# EAGLE design tron_disc (EAGLE 5.11)

## Sheet 1 of 3
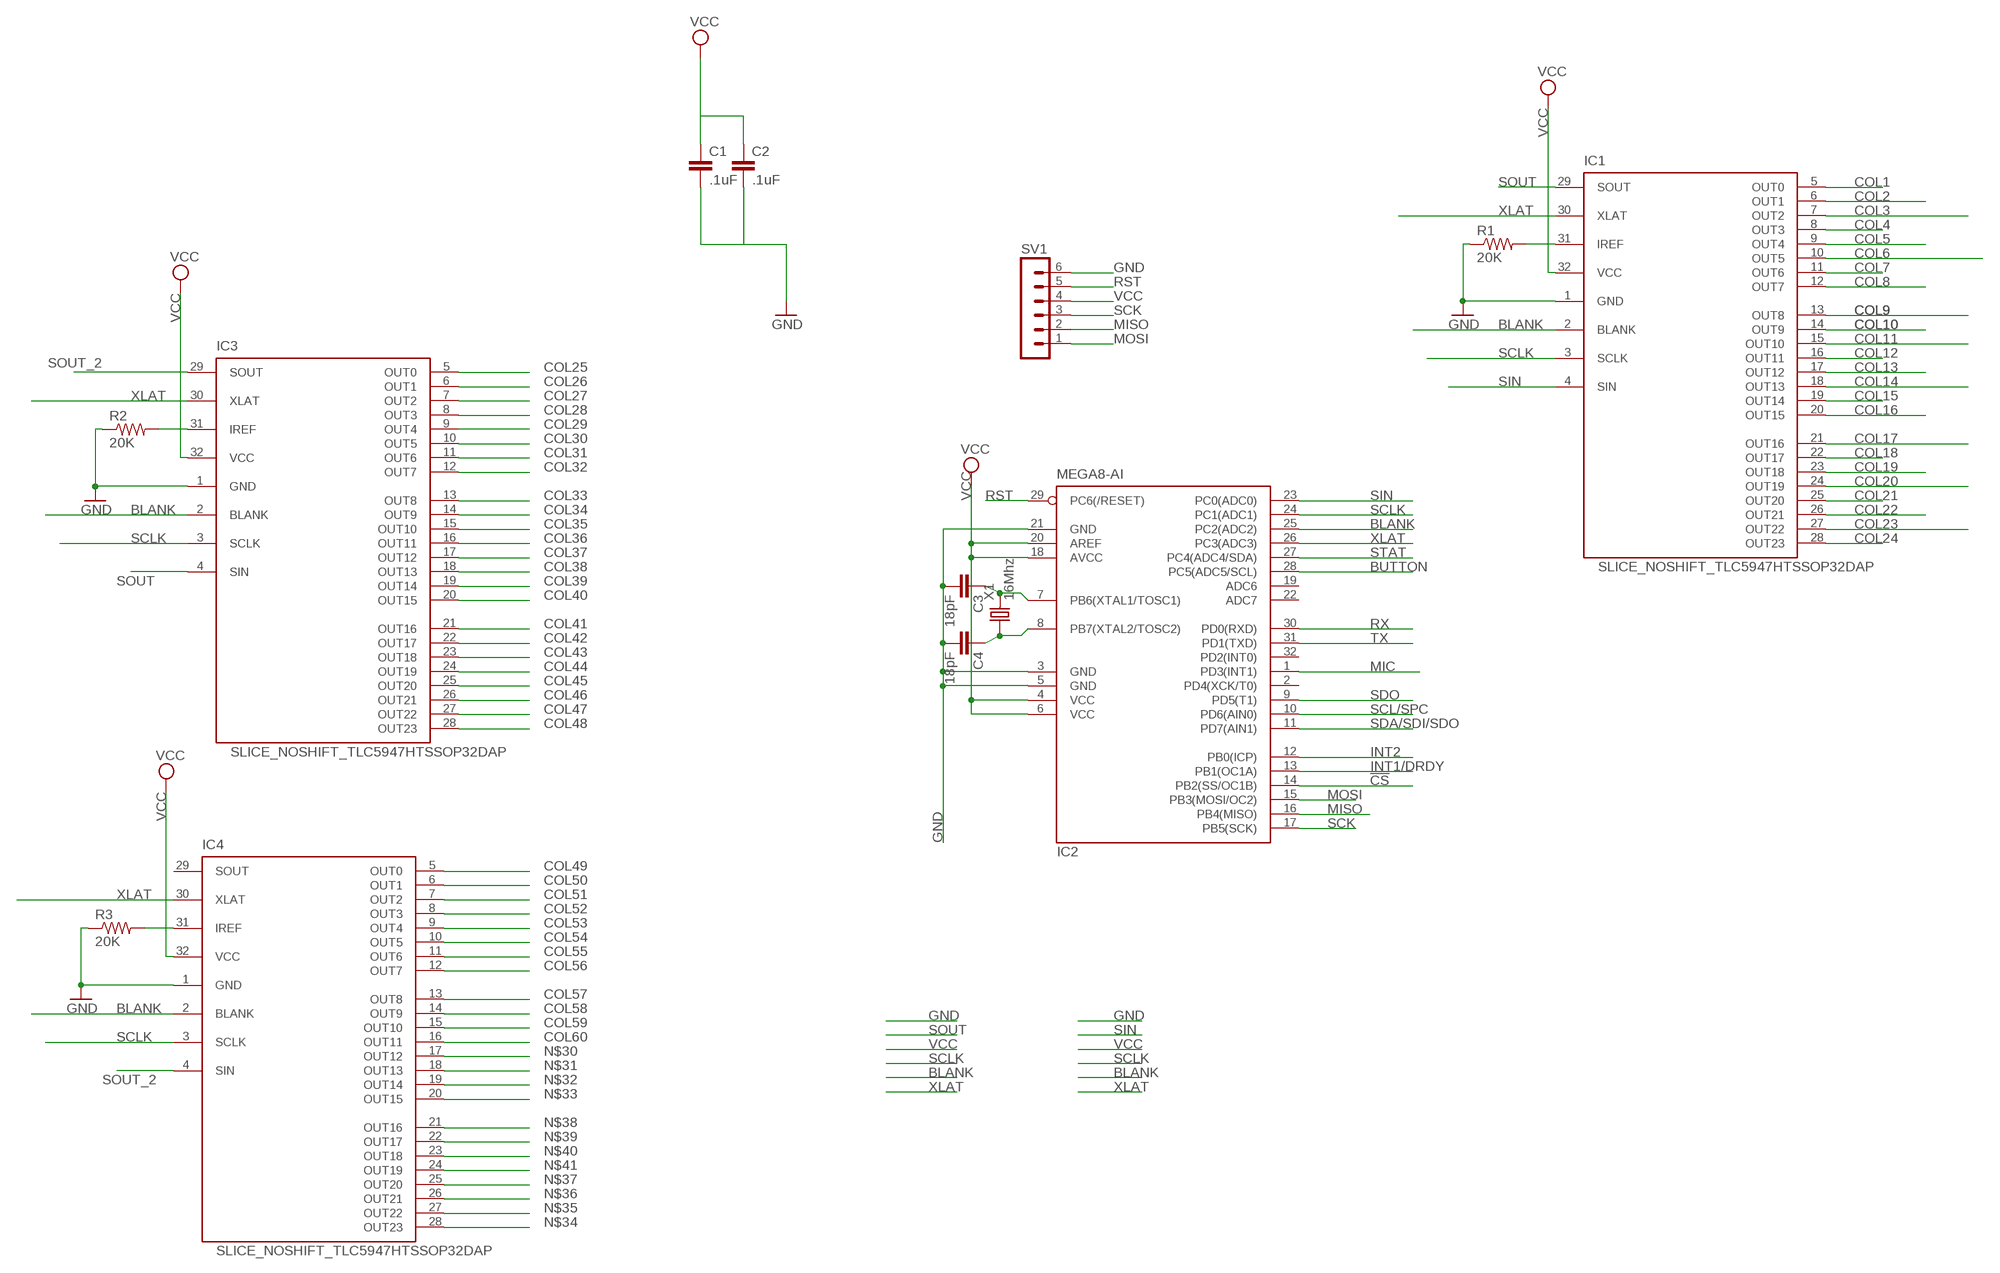
[diagram p0: schematic, sheet 1]

### Parts
C1  .1uF  CAP0805  [0805]
C2  .1uF  CAP0805  [0805]
C3  18pF  CAP0805  [0805]
C4  18pF  CAP0805  [0805]
IC1  SLICE_NOSHIFT_TLC5947HTSSOP32DAP  [HTSSOP32DAP]
IC2  MEGA8-AI  [TQFP32-08]
IC3  SLICE_NOSHIFT_TLC5947HTSSOP32DAP  [HTSSOP32DAP]
IC4  SLICE_NOSHIFT_TLC5947HTSSOP32DAP  [HTSSOP32DAP]
R1  20K  R-US_R0805  [R0805]
R2  20K  R-US_R0805  [R0805]
R3  20K  R-US_R0805  [R0805]
SV1  MA06-1  [MA06-1]
X1  16Mhz  CRYSTAL-5032  [5032]

### Nets
!CS: IC2.14(PB2(SS/OC1B))
BLANK: IC1.2(BLANK) IC2.25(PC2(ADC2)) IC3.2(BLANK) IC4.2(BLANK)
BUTTON: IC2.28(PC5(ADC5/SCL)) ; also sheet 3
COL1: IC1.5(OUT0) ; also sheet 2
COL2: IC1.6(OUT1) ; also sheet 2
COL3: IC1.7(OUT2) ; also sheet 2
COL4: IC1.8(OUT3) ; also sheet 2
COL5: IC1.9(OUT4) ; also sheet 2
COL6: IC1.10(OUT5) ; also sheet 2
COL7: IC1.11(OUT6) ; also sheet 2
COL8: IC1.12(OUT7) ; also sheet 2
COL9: IC1.13(OUT8) ; also sheet 2
COL10: IC1.14(OUT9) ; also sheet 2
COL11: IC1.15(OUT10) ; also sheet 2
COL12: IC1.16(OUT11) ; also sheet 2
COL13: IC1.17(OUT12) ; also sheet 2
COL14: IC1.18(OUT13) ; also sheet 2
COL15: IC1.19(OUT14) ; also sheet 2
COL16: IC1.20(OUT15) ; also sheet 2
COL17: IC1.21(OUT16) ; also sheet 2
COL18: IC1.22(OUT17) ; also sheet 2
COL19: IC1.23(OUT18) ; also sheet 2
COL20: IC1.24(OUT19) ; also sheet 2
COL21: IC1.25(OUT20) ; also sheet 2
COL22: IC1.26(OUT21) ; also sheet 2
COL23: IC1.27(OUT22) ; also sheet 2
COL24: IC1.28(OUT23) ; also sheet 2
COL25: IC3.5(OUT0) ; also sheet 2
COL26: IC3.6(OUT1) ; also sheet 2
COL27: IC3.7(OUT2) ; also sheet 2
COL28: IC3.8(OUT3) ; also sheet 2
COL29: IC3.9(OUT4) ; also sheet 2
COL30: IC3.10(OUT5) ; also sheet 2
COL31: IC3.11(OUT6) ; also sheet 2
COL32: IC3.12(OUT7) ; also sheet 2
COL33: IC3.13(OUT8) ; also sheet 2
COL34: IC3.14(OUT9) ; also sheet 2
COL35: IC3.15(OUT10) ; also sheet 2
COL36: IC3.16(OUT11) ; also sheet 2
COL37: IC3.17(OUT12) ; also sheet 2
COL38: IC3.18(OUT13) ; also sheet 2
COL39: IC3.19(OUT14) ; also sheet 2
COL40: IC3.20(OUT15) ; also sheet 2
COL41: IC3.21(OUT16) ; also sheet 2
COL42: IC3.22(OUT17) ; also sheet 2
COL43: IC3.23(OUT18) ; also sheet 2
COL44: IC3.24(OUT19) ; also sheet 2
COL45: IC3.25(OUT20) ; also sheet 2
COL46: IC3.26(OUT21) ; also sheet 2
COL47: IC3.27(OUT22) ; also sheet 2
COL48: IC3.28(OUT23) ; also sheet 2
COL49: IC4.5(OUT0) ; also sheet 2
COL50: IC4.6(OUT1) ; also sheet 2
COL51: IC4.7(OUT2) ; also sheet 2
COL52: IC4.8(OUT3) ; also sheet 2
COL53: IC4.9(OUT4) ; also sheet 2
COL54: IC4.10(OUT5) ; also sheet 2
COL55: IC4.11(OUT6) ; also sheet 2
COL56: IC4.12(OUT7) ; also sheet 2
COL57: IC4.13(OUT8) ; also sheet 2
COL58: IC4.14(OUT9) ; also sheet 2
COL59: IC4.15(OUT10) ; also sheet 2
COL60: IC4.16(OUT11) ; also sheet 2
GND: C1.2 C2.2 C3.2 C4.2 IC1.1(GND) IC2.3(GND) IC2.5(GND) IC2.21(GND) IC3.1(GND) IC4.1(GND) R1.1 R2.1 R3.1 SV1.6 ; also sheet 3
INT1/DRDY: IC2.13(PB1(OC1A))
INT2: IC2.12(PB0(ICP))
MIC: IC2.1(PD3(INT1))
MISO: IC2.16(PB4(MISO)) SV1.2
MOSI: IC2.15(PB3(MOSI/OC2)) SV1.1
N$1: IC3.31(IREF) R2.2
N$7: C3.1 IC2.7(PB6(XTAL1/TOSC1)) X1.2
N$8: C4.1 IC2.8(PB7(XTAL2/TOSC2)) X1.1
N$13: IC1.31(IREF) R1.2
N$30: IC4.17(OUT12)
N$31: IC4.18(OUT13)
N$32: IC4.19(OUT14)
N$33: IC4.20(OUT15)
N$34: IC4.28(OUT23)
N$35: IC4.27(OUT22)
N$36: IC4.26(OUT21)
N$37: IC4.25(OUT20)
N$38: IC4.21(OUT16)
N$39: IC4.22(OUT17)
N$40: IC4.23(OUT18)
N$41: IC4.24(OUT19)
N$64: IC4.31(IREF) R3.2
RST: IC2.29(PC6(/RESET)) SV1.5 ; also sheet 3
RX: IC2.30(PD0(RXD))
SCK: IC2.17(PB5(SCK)) SV1.3
SCL/SPC: IC2.10(PD6(AIN0))
SCLK: IC1.3(SCLK) IC2.24(PC1(ADC1)) IC3.3(SCLK) IC4.3(SCLK)
SDA/SDI/SDO: IC2.11(PD7(AIN1))
SDO: IC2.9(PD5(T1))
SIN: IC1.4(SIN) IC2.23(PC0(ADC0))
SOUT: IC1.29(SOUT) IC3.4(SIN)
SOUT_2: IC3.29(SOUT) IC4.4(SIN)
STAT: IC2.27(PC4(ADC4/SDA))
TX: IC2.31(PD1(TXD))
VCC: C1.1 C2.1 IC1.32(VCC) IC2.4(VCC) IC2.6(VCC) IC2.18(AVCC) IC2.20(AREF) IC3.32(VCC) IC4.32(VCC) SV1.4 ; also sheet 2
XLAT: IC1.30(XLAT) IC2.26(PC3(ADC3)) IC3.30(XLAT) IC4.30(XLAT)
Unconnected: IC2.2(PD4(XCK/T0)) IC2.19(ADC6) IC2.22(ADC7) IC2.32(PD2(INT0)) IC4.29(SOUT)

## Sheet 2 of 3
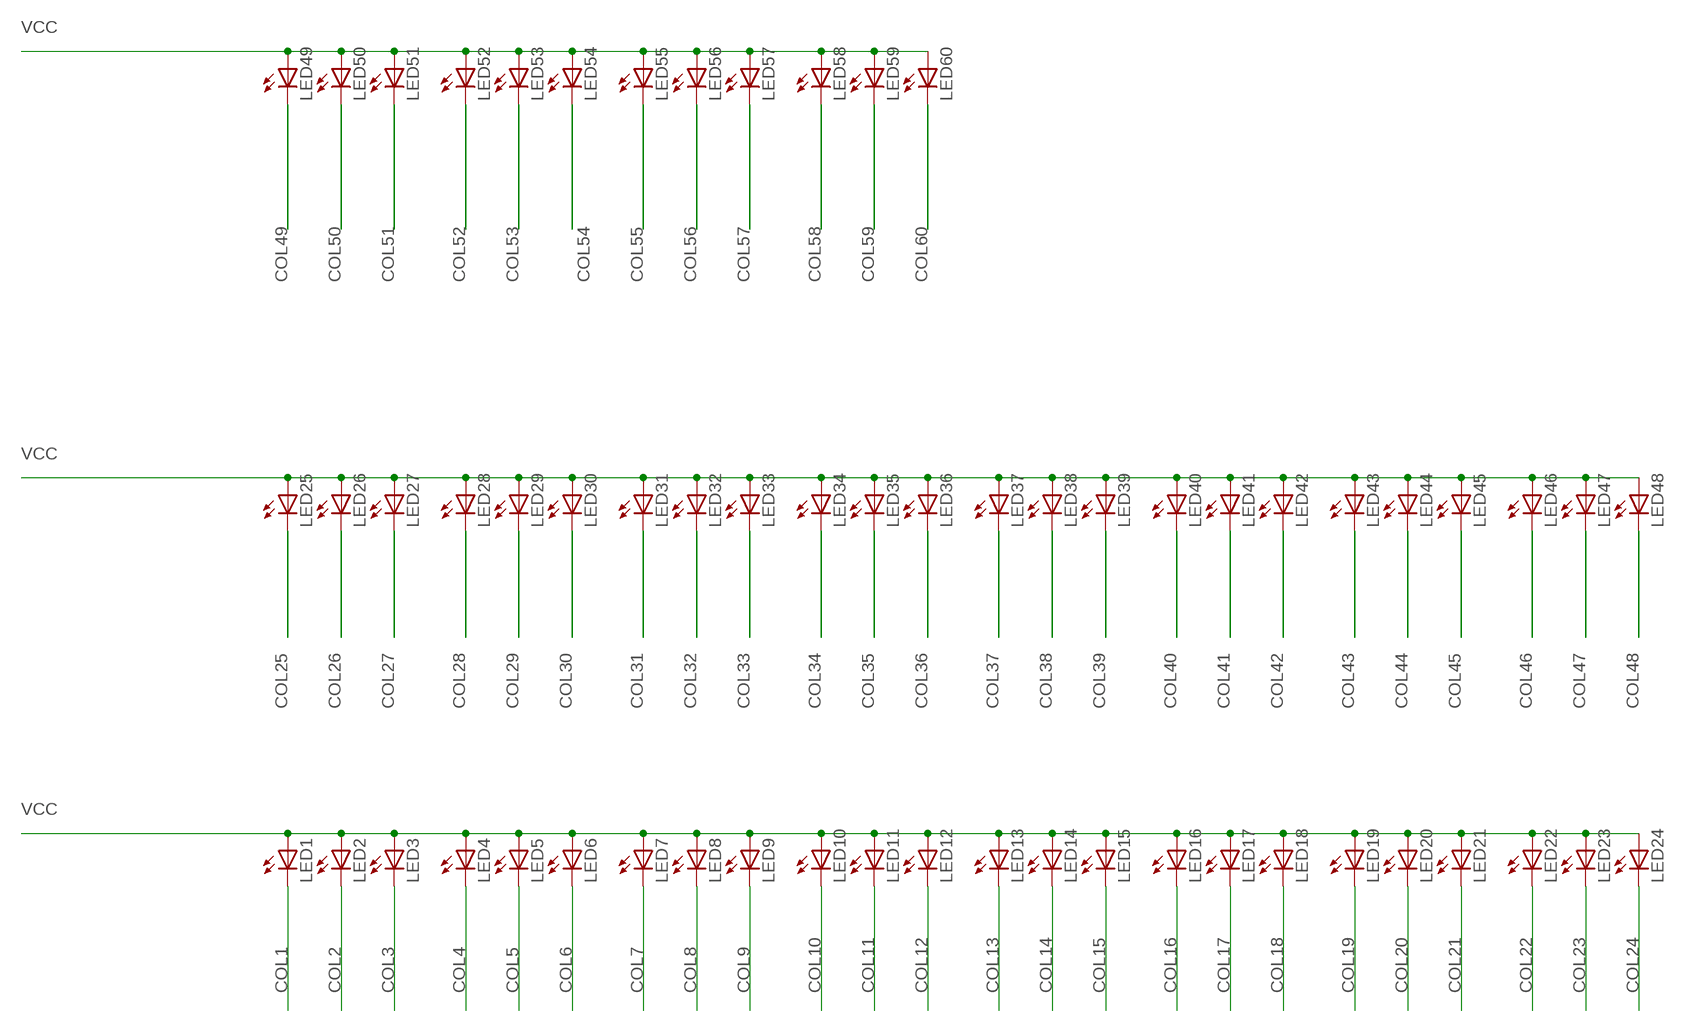
[diagram p1: schematic, sheet 2]

### Parts
LED1  LED5MM  [LED5MM]
LED2  LED5MM  [LED5MM]
LED3  LED5MM  [LED5MM]
LED4  LED5MM  [LED5MM]
LED5  LED5MM  [LED5MM]
LED6  LED5MM  [LED5MM]
LED7  LED5MM  [LED5MM]
LED8  LED5MM  [LED5MM]
LED9  LED5MM  [LED5MM]
LED10  LED5MM  [LED5MM]
LED11  LED5MM  [LED5MM]
LED12  LED5MM  [LED5MM]
LED13  LED5MM  [LED5MM]
LED14  LED5MM  [LED5MM]
LED15  LED5MM  [LED5MM]
LED16  LED5MM  [LED5MM]
LED17  LED5MM  [LED5MM]
LED18  LED5MM  [LED5MM]
LED19  LED5MM  [LED5MM]
LED20  LED5MM  [LED5MM]
LED21  LED5MM  [LED5MM]
LED22  LED5MM  [LED5MM]
LED23  LED5MM  [LED5MM]
LED24  LED5MM  [LED5MM]
LED25  LED5MM  [LED5MM]
LED26  LED5MM  [LED5MM]
LED27  LED5MM  [LED5MM]
LED28  LED5MM  [LED5MM]
LED29  LED5MM  [LED5MM]
LED30  LED5MM  [LED5MM]
LED31  LED5MM  [LED5MM]
LED32  LED5MM  [LED5MM]
LED33  LED5MM  [LED5MM]
LED34  LED5MM  [LED5MM]
LED35  LED5MM  [LED5MM]
LED36  LED5MM  [LED5MM]
LED37  LED5MM  [LED5MM]
LED38  LED5MM  [LED5MM]
LED39  LED5MM  [LED5MM]
LED40  LED5MM  [LED5MM]
LED41  LED5MM  [LED5MM]
LED42  LED5MM  [LED5MM]
LED43  LED5MM  [LED5MM]
LED44  LED5MM  [LED5MM]
LED45  LED5MM  [LED5MM]
LED46  LED5MM  [LED5MM]
LED47  LED5MM  [LED5MM]
LED48  LED5MM  [LED5MM]
LED49  LED5MM  [LED5MM]
LED50  LED5MM  [LED5MM]
LED51  LED5MM  [LED5MM]
LED52  LED5MM  [LED5MM]
LED53  LED5MM  [LED5MM]
LED54  LED5MM  [LED5MM]
LED55  LED5MM  [LED5MM]
LED56  LED5MM  [LED5MM]
LED57  LED5MM  [LED5MM]
LED58  LED5MM  [LED5MM]
LED59  LED5MM  [LED5MM]
LED60  LED5MM  [LED5MM]

### Nets
COL1: LED1.K(C) ; also sheet 1
COL2: LED2.K(C) ; also sheet 1
COL3: LED3.K(C) ; also sheet 1
COL4: LED4.K(C) ; also sheet 1
COL5: LED5.K(C) ; also sheet 1
COL6: LED6.K(C) ; also sheet 1
COL7: LED7.K(C) ; also sheet 1
COL8: LED8.K(C) ; also sheet 1
COL9: LED9.K(C) ; also sheet 1
COL10: LED10.K(C) ; also sheet 1
COL11: LED11.K(C) ; also sheet 1
COL12: LED12.K(C) ; also sheet 1
COL13: LED13.K(C) ; also sheet 1
COL14: LED14.K(C) ; also sheet 1
COL15: LED15.K(C) ; also sheet 1
COL16: LED16.K(C) ; also sheet 1
COL17: LED17.K(C) ; also sheet 1
COL18: LED18.K(C) ; also sheet 1
COL19: LED19.K(C) ; also sheet 1
COL20: LED20.K(C) ; also sheet 1
COL21: LED21.K(C) ; also sheet 1
COL22: LED22.K(C) ; also sheet 1
COL23: LED23.K(C) ; also sheet 1
COL24: LED24.K(C) ; also sheet 1
COL25: LED25.K(C) ; also sheet 1
COL26: LED26.K(C) ; also sheet 1
COL27: LED27.K(C) ; also sheet 1
COL28: LED28.K(C) ; also sheet 1
COL29: LED29.K(C) ; also sheet 1
COL30: LED30.K(C) ; also sheet 1
COL31: LED31.K(C) ; also sheet 1
COL32: LED32.K(C) ; also sheet 1
COL33: LED33.K(C) ; also sheet 1
COL34: LED34.K(C) ; also sheet 1
COL35: LED35.K(C) ; also sheet 1
COL36: LED36.K(C) ; also sheet 1
COL37: LED37.K(C) ; also sheet 1
COL38: LED38.K(C) ; also sheet 1
COL39: LED39.K(C) ; also sheet 1
COL40: LED40.K(C) ; also sheet 1
COL41: LED41.K(C) ; also sheet 1
COL42: LED42.K(C) ; also sheet 1
COL43: LED43.K(C) ; also sheet 1
COL44: LED44.K(C) ; also sheet 1
COL45: LED45.K(C) ; also sheet 1
COL46: LED46.K(C) ; also sheet 1
COL47: LED47.K(C) ; also sheet 1
COL48: LED48.K(C) ; also sheet 1
COL49: LED49.K(C) ; also sheet 1
COL50: LED50.K(C) ; also sheet 1
COL51: LED51.K(C) ; also sheet 1
COL52: LED52.K(C) ; also sheet 1
COL53: LED53.K(C) ; also sheet 1
COL54: LED54.K(C) ; also sheet 1
COL55: LED55.K(C) ; also sheet 1
COL56: LED56.K(C) ; also sheet 1
COL57: LED57.K(C) ; also sheet 1
COL58: LED58.K(C) ; also sheet 1
COL59: LED59.K(C) ; also sheet 1
COL60: LED60.K(C) ; also sheet 1
VCC: LED1.A LED2.A LED3.A LED4.A LED5.A LED6.A LED7.A LED8.A LED9.A LED10.A LED11.A LED12.A LED13.A LED14.A LED15.A LED16.A LED17.A LED18.A LED19.A LED20.A LED21.A LED22.A LED23.A LED24.A LED25.A LED26.A LED27.A LED28.A LED29.A LED30.A LED31.A LED32.A LED33.A LED34.A LED35.A LED36.A LED37.A LED38.A LED39.A LED40.A LED41.A LED42.A LED43.A LED44.A LED45.A LED46.A LED47.A LED48.A LED49.A LED50.A LED51.A LED52.A LED53.A LED54.A LED55.A LED56.A LED57.A LED58.A LED59.A LED60.A ; also sheet 1

## Sheet 3 of 3
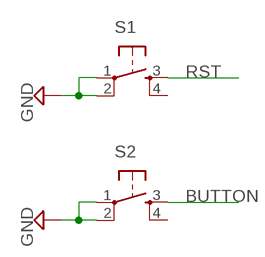
[diagram p2: schematic, sheet 3]

### Parts
S1  TAC_SWITCHSMD  [TACTILE_SWITCH_SMD]
S2  TAC_SWITCHSMD  [TACTILE_SWITCH_SMD]

### Nets
BUTTON: S2.3 ; also sheet 1
GND: S1.1 S1.2 S2.1 S2.2 ; also sheet 1
RST: S1.3 ; also sheet 1
Unconnected: S1.4 S2.4

## Library data of the parts
C1-C4 = slice_noshift:CAP: Capacitor Standard 0603 ceramic capacitor, and 0.1" leaded capacitor.
IC1 IC3 IC4 = 23b_clock_noleds:SLICE_NOSHIFT_TLC5947
IC2 = atmel:MEGA8: MICROCONTROLLER 8 Kbytes FLASH, 1 kbytes SRAM, 512 bytes EEPROM, USART, 6-channel 10 bit ADC, 2-channel 8 bit ADC Pin compatible with Atmega48, ATMega88, ATMega168 Source: avr.lbr; MPN: ATMEGA8-16AU; OC_FARNELL: 9171371; OC_NEWARK: 73M8863
LED1-LED60 = led:LED: LED OSRAM: - CHIPLED LG R971, LG N971, LY N971, LG Q971, LY Q971, LO R971, LY R971 LH N974, LH R974 LS Q976, LO Q976, LY Q976 LO Q996 - Hyper CHIPLED LW Q18S LB Q993, LB Q99A, LB R99A - SideLED LS A670, LO A670, LY A670, LG A670, LP A670 LB A673, LV A673, LT A673, LW A673 LH A674 LY A675 LS A676, LA A676, LO A676, LY A676, LW A676 LS A679, LY A679, LG A679 - Hyper Micro SIDELED® LS Y876, LA Y876, LO Y876, LY Y876 LT Y87S - SmartLED LW L88C, LW L88S LB L89C, LB L89S, LG L890 LS L89K, LO L89K, LY L89K LS L896, LA L896, LO L896, LY L896 - TOPLED LS T670, LO T670, LY T670, LG T670, LP T670 LSG T670, LSP T670, LSY T670, LOP T670, LYG T670 LG T671, LOG T671, LSG T671 LB T673, LV T673, LT T673, LW T673 LH T674 LS T676, LA T676, LO T676, LY T676, LB T676, LH T676, LSB T676, LW T676 LB T67C, LV T67C, LT T67C, LS T67K, LO T67K, LY T67K, LW E67C LS E67B, LA E67B, LO E67B, LY E67B, LB E67C, LV E67C, LT E67C LW T67C LS T679, LY T679, LG T679 LS T770, LO T770, LY T770, LG T770, LP T770 LB T773, LV T773, LT T773, LW T773 LH T774 LS E675, LA E675, LY E675, LS T675 LS T776, LA T776, LO T776, LY T776, LB T776 LHGB T686 LT T68C, LB T68C - Hyper Mini TOPLED® LB M676 - Mini TOPLED Santana® LG M470 LS M47K, LO M47K, LY M47K Source: http://www.osram.convergy.de LUXEON: - LUMILED® LXK2-PW12-R00, LXK2-PW12-S00, LXK2-PW14-U00, LXK2-PW14-V00 LXK2-PM12-R00, LXK2-PM12-S00, LXK2-PM14-U00 LXK2-PE12-Q00, LXK2-PE12-R00, LXK2-PE12-S00, LXK2-PE14-T00, LXK2-PE14-U00 LXK2-PB12-K00, LXK2-PB12-L00, LXK2-PB12-M00, LXK2-PB14-N00, LXK2-PB14-P00, LXK2-PB14-Q00 LXK2-PR12-L00, LXK2-PR12-M00, LXK2-PR14-Q00, LXK2-PR14-R00 LXK2-PD12-Q00, LXK2-PD12-R00, LXK2-PD12-S00 LXK2-PH12-R00, LXK2-PH12-S00 LXK2-PL12-P00, LXK2-PL12-Q00, LXK2-PL12-R00 Source: www.luxeon.com KINGBRIGHT: KA-3528ASYC Source: www.kingbright.com
R1-R3 = rcl:R-US_: RESISTOR, American symbol
S1 S2 = SparkFun:TAC_SWITCH: Momentary Switch Button commonly used for reset or general input. Spark Fun Electronics SKU : COM-00097
SV1 = NSL:MA06-1: PIN HEADER
X1 = NSL_MiniQuad:CRYSTAL*: CRYSTAL

## Net classes
0 default: width 0.254 mm

## Board
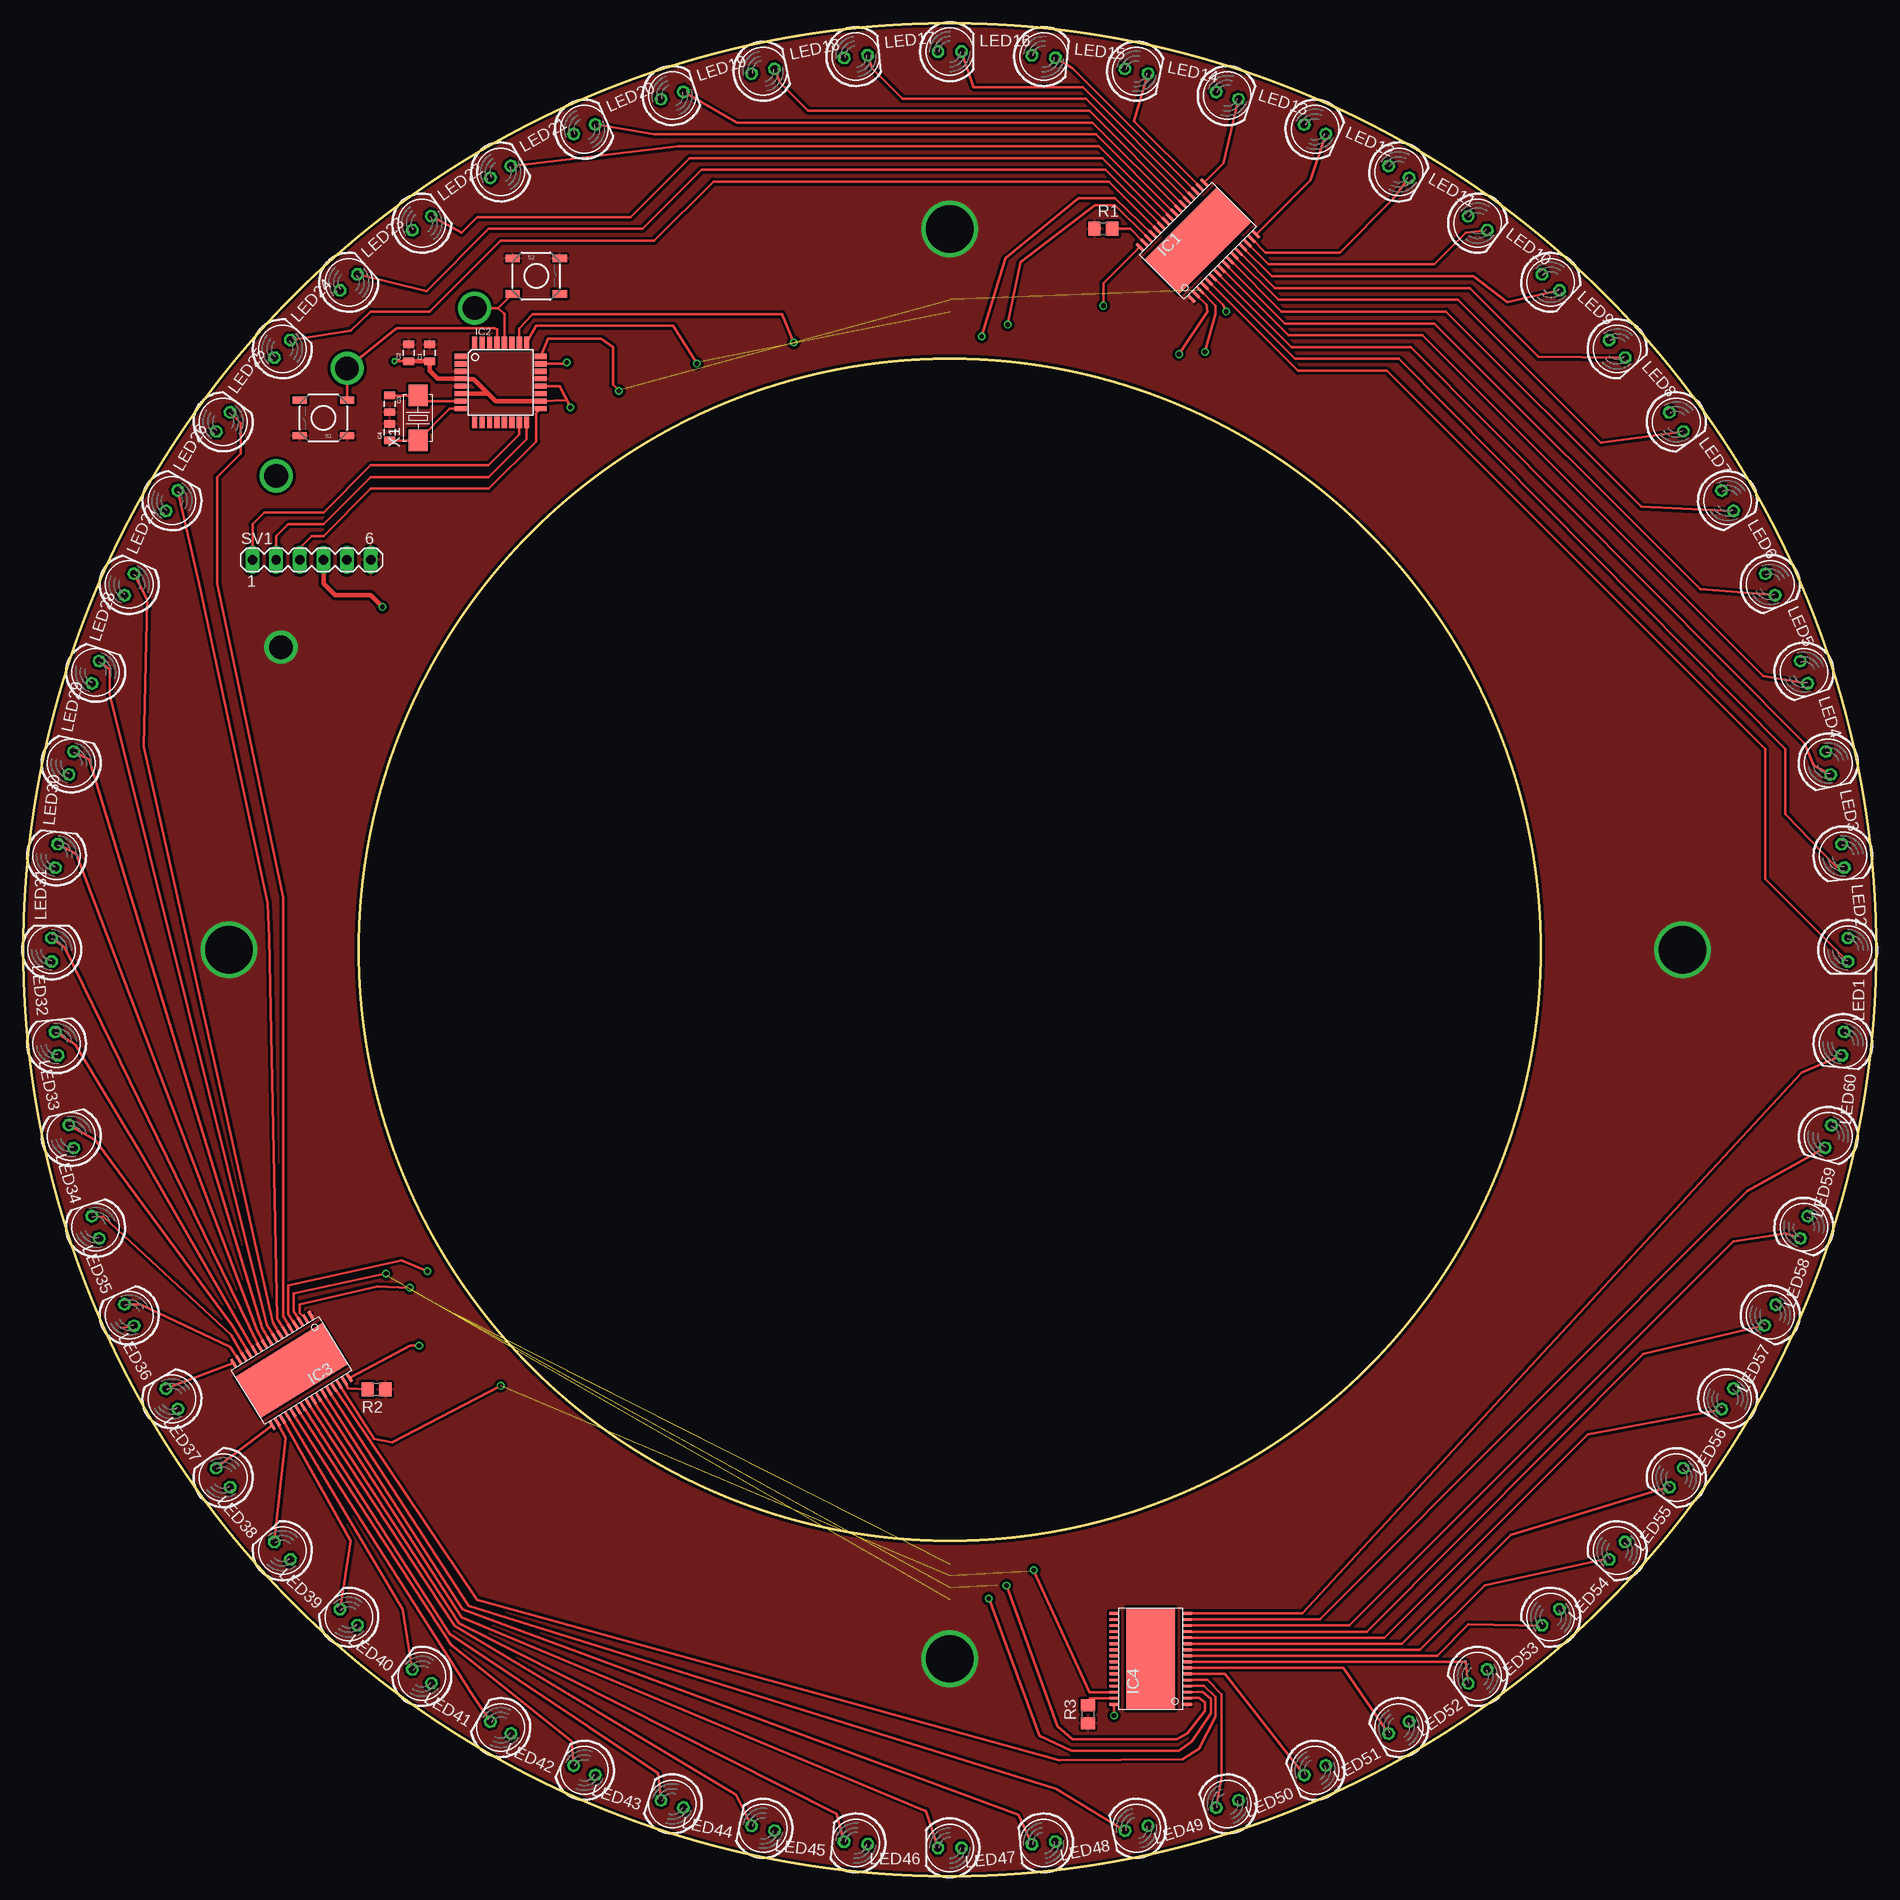
[diagram p3: board, top side]
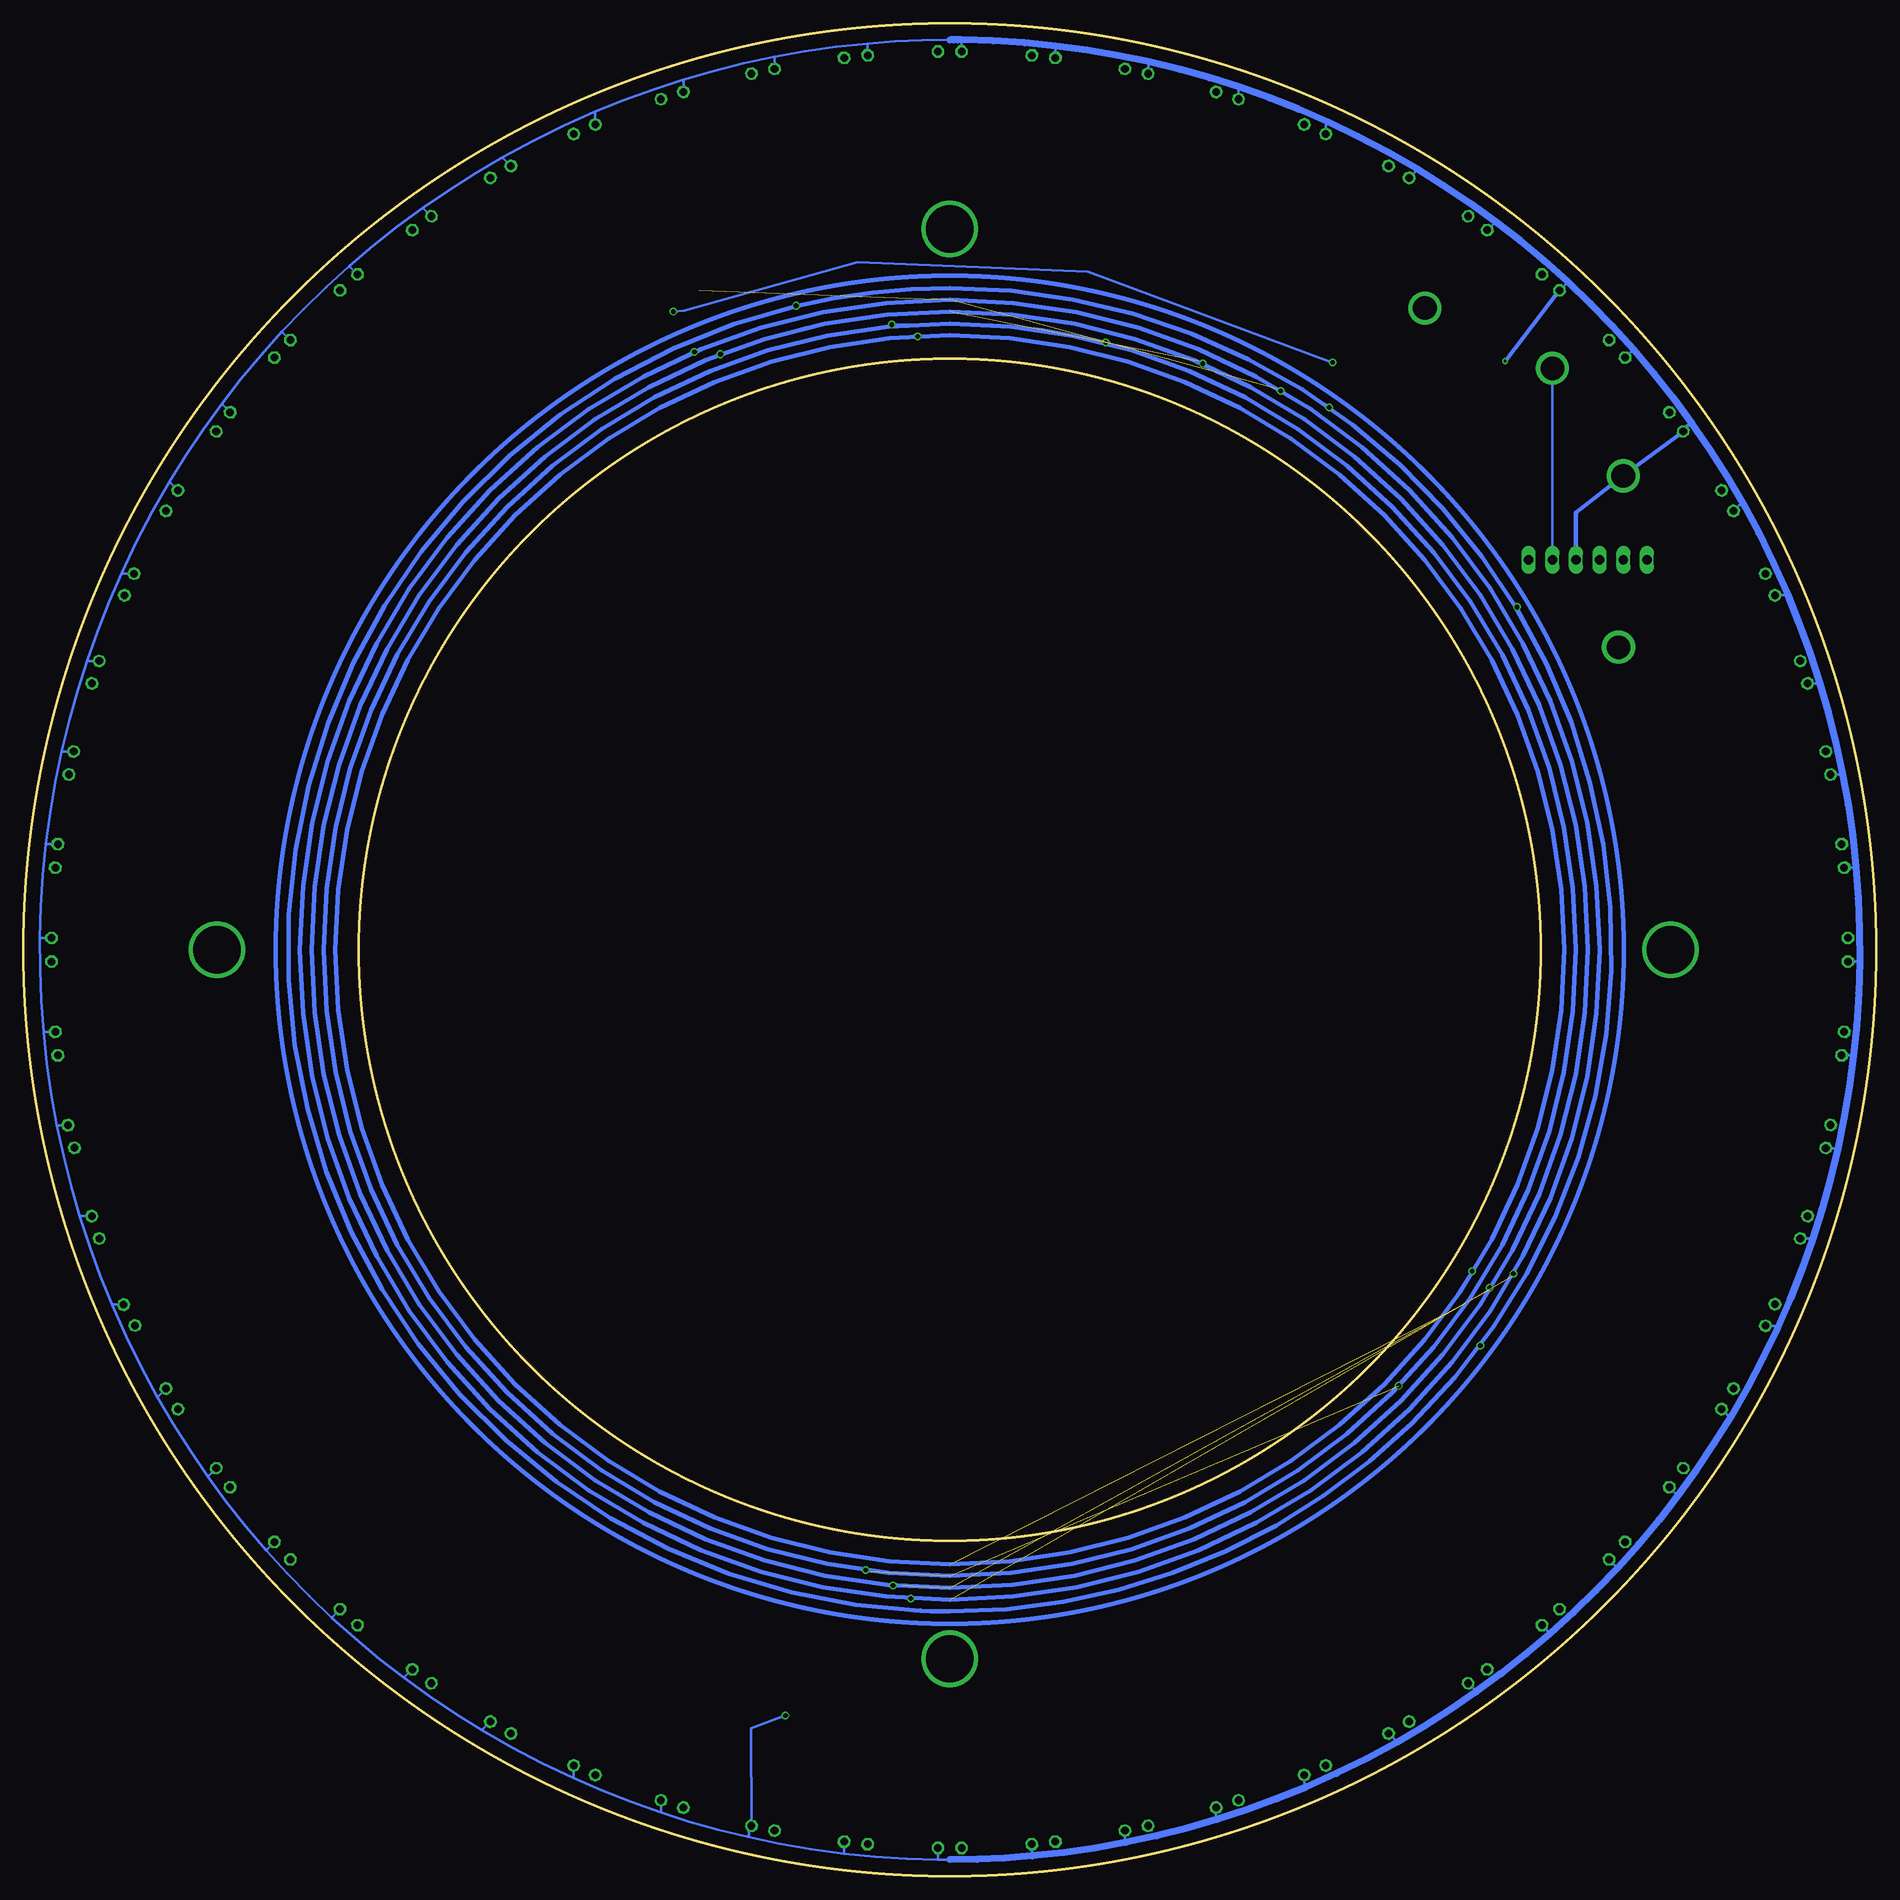
[diagram p4: board, bottom side, seen from below]

Size 199.14 x 199.14 mm. Coordinates in mm from the lower left corner, seen from the top.
Outline: circle at 99.57,99.57 radius 99.57
Outline: circle at 99.57,99.57 radius 63.5
Copper layers (1*16): Top 0.035mm / dielectric 1.5mm / Bottom 0.035mm
Design rules "ITead_rule": minimum track width 6mil, minimum drill 12mil, track to track 6mil, track to pad 6mil, pad to pad 6mil, via to via 6mil, smd to smd 0mil, copper to edge 10mil, drill to drill 10mil, minimum pad ring 10mil, minimum via ring 6mil, stop-mask expansion 2mil, vias tented up to drill 100mil, thermal gap 10mil

### Footprints (pad centres in the part's own frame; a part is rotated, then mirrored left to right if it is on the bottom)
0805 = smd 0.8 x 1.2: 1 -0.9,0; 2 0.9,0
HTSSOP32DAP = smd 0.3 x 1: 1 -4.875,-3.95; 2 -4.225,-3.95; 3 -3.575,-3.95; 4 -2.925,-3.95; 5 -2.275,-3.95; 6 -1.625,-3.95; 7 -0.975,-3.95; 8 -0.325,-3.95; 9 0.325,-3.95; 10 0.975,-3.95; 11 1.625,-3.95; 12 2.275,-3.95; 13 2.925,-3.95; 14 3.575,-3.95; 15 4.225,-3.95; 16 4.875,-3.95; 17 4.875,3.95; 18 4.225,3.95; 19 3.575,3.95; 20 2.925,3.95; 21 2.275,3.95; 22 1.625,3.95; 23 0.975,3.95; 24 0.325,3.95; 25 -0.325,3.95; 26 -0.975,3.95; 27 -1.625,3.95; 28 -2.275,3.95; 29 -2.925,3.95; 30 -3.575,3.95; 31 -4.225,3.95; 32 -4.875,3.95 | smd 11 x 5.2: EXP 0,0
TQFP32-08 = smd 1.27 x 0.559: 1 -4.293,2.8; 2 -4.293,2; 3 -4.293,1.2; 4 -4.293,0.4; 5 -4.293,-0.4; 6 -4.293,-1.2; 7 -4.293,-2; 8 -4.293,-2.8; 17 4.293,-2.8; 18 4.293,-2; 19 4.293,-1.2; 20 4.293,-0.4; 21 4.293,0.4; 22 4.293,1.2; 23 4.293,2; 24 4.293,2.8 | smd 0.559 x 1.27: 9 -2.8,-4.293; 10 -2,-4.293; 11 -1.2,-4.293; 12 -0.4,-4.293; 13 0.4,-4.293; 14 1.2,-4.293; 15 2,-4.293; 16 2.8,-4.293; 25 2.8,4.293; 26 2,4.293; 27 1.2,4.293; 28 0.4,4.293; 29 -0.4,4.293; 30 -1.2,4.293; 31 -2,4.293; 32 -2.8,4.293
LED5MM = drill 0.813 octagon: A -1.27,0; K 1.27,0
R0805 = smd 1.3 x 1.5: 1 -0.95,0; 2 0.95,0
TACTILE_SWITCH_SMD = smd 1.524 x 0.762: 1 -2.54,1.905; 2 2.54,1.905; 3 -2.54,-1.905; 4 2.54,-1.905
MA06-1 = drill 1.016 long: 1 -6.35,0; 2 -3.81,0; 3 -1.27,0; 4 1.27,0; 5 3.81,0; 6 6.35,0
5032 = smd 2.286 x 2.032: 1 -2.413,0; 2 2.413,0

### Placement (x,y rotation side)
C1  43.69,163.7 90 top
C2  41.4,163.7 90 top
C3  39.37,158.24 270 top
C4  39.37,155.19 90 top
IC1  126.24,175.77 45 top
IC2  51.31,160.53 0 top
IC3  28.83,54.36 211.7 top
IC4  121.16,23.37 90 top
LED1  196.09,99.57 270 top
LED2  195.56,109.66 276 top
LED3  193.98,119.64 282 top
LED4  191.36,129.4 288 top
LED5  187.74,138.83 294 top
LED6  183.16,147.83 300 top
LED7  177.66,156.3 306 top
LED8  171.3,164.15 312 top
LED9  164.15,171.3 318 top
LED10  156.3,177.66 324 top
LED11  147.83,183.16 330 top
LED12  138.83,187.74 336 top
LED13  129.4,191.36 342 top
LED14  119.64,193.98 348 top
LED15  109.66,195.56 354 top
LED16  99.57,196.09 0 top
LED17  89.48,195.56 6 top
LED18  79.5,193.98 12 top
LED19  69.74,191.36 18 top
LED20  60.31,187.74 24 top
LED21  51.31,183.16 30 top
LED22  42.83,177.66 36 top
LED23  34.98,171.3 42 top
LED24  27.84,164.15 48 top
LED25  21.48,156.3 54 top
LED26  15.98,147.83 60 top
LED27  11.39,138.83 66 top
LED28  7.77,129.4 72 top
LED29  5.16,119.64 78 top
LED30  3.58,109.66 84 top
LED31  3.05,99.57 90 top
LED32  3.58,89.48 96 top
LED33  5.16,79.5 102 top
LED34  7.77,69.74 108 top
LED35  11.39,60.31 114 top
LED36  15.98,51.31 120 top
LED37  21.48,42.83 126 top
LED38  27.84,34.98 132 top
LED39  34.98,27.84 138 top
LED40  42.83,21.48 144 top
LED41  51.31,15.98 150 top
LED42  60.31,11.39 156 top
LED43  69.74,7.77 162 top
LED44  79.5,5.16 168 top
LED45  89.48,3.58 174 top
LED46  99.57,3.05 180 top
LED47  109.66,3.58 186 top
LED48  119.64,5.16 192 top
LED49  129.4,7.77 198 top
LED50  138.83,11.39 204 top
LED51  147.83,15.98 210 top
LED52  156.3,21.48 216 top
LED53  164.15,27.84 222 top
LED54  171.3,34.98 228 top
LED55  177.66,42.83 234 top
LED56  183.16,51.31 240 top
LED57  187.74,60.31 241.7 top
LED58  191.36,69.74 251.5 top
LED59  193.98,79.5 254 top
LED60  195.56,89.48 264 top
R1  116.08,177.04 0 top
R2  37.97,52.32 180 top
R3  114.43,17.4 90 top
S1  32.26,156.72 180 top
S2  55.12,171.96 0 top
SV1  30.99,141.48 0 top
X1  42.42,156.72 90 top

### Tracks (layer width: path | path; a pad name or v marks a point on that pad's centre or on a via)
BLANK  (via drill 0.51)  (3 unrouted)
  Top 0.254: 126.36,19.18 IC4.2 125.14,19.18 126.36,19.18 | IC1.2 127.13,168.91 127.25,168.15 v124.21,163.58 | 126.36,19.18 127,18.67 127,17.78 125.09,15.37 123.95,14.73 112.78,14.73 111.12,16.13 v105.66,31.24 | IC3.2 29.72,60.57 29.72,61.47 38.1,63.37 v41.53,63.25 | IC2.25 55.12,166.62 69.85,166.62 v72.39,162.56
  Bottom 0.254: v124.21,163.58 123.83,163.7 119.38,165.23 114.94,166.5 110.74,167.26 105.66,167.77 101.47,168.15 99.57,168.15 | v105.66,31.24 104.65,31.24 | v41.53,63.25 41.66,62.99 | v72.39,162.56 72.9,162.81
  Bottom 0.508: 99.57,168.15 arc-180 99.57,30.99 arc-180 99.57,168.15
BUTTON  (via drill 2.54)
  Top 0.254: IC2.28 51.71,167.91 51.67,167.91 51.05,168.53 | 51.05,168.53 v48.51,168.53 | 51.05,168.53 S2.3
COL1
  Top 0.254: IC1.5 136.99,161.8 146.56,161.8 187.2,121.16 187.2,107.19 LED1.K
COL2
  Top 0.254: IC1.6 136.64,163.07 147.83,163.07 189.36,121.16 189.36,114.17 194.82,108.46 195.63,108.46 LED2.K
COL3
  Top 0.254: IC1.7 136.29,164.34 149.1,164.34 191.39,121.79 192.41,119.38 LED3.K
COL4
  Top 0.254: IC1.8 135.94,165.61 150.37,165.61 186.97,129 LED4.K
COL5
  Top 0.254: IC1.9 135.59,166.88 151.64,166.88 180.21,138.31 LED5.K
COL6
  Top 0.254: IC1.10 135.24,168.15 152.91,168.15 173.86,147.19 LED6.K
COL7
  Top 0.254: IC1.11 134.89,169.42 154.18,169.42 169.55,154.05 LED7.K
COL8
  Top 0.254: IC1.12 134.53,170.69 155.45,170.69 162.83,163.3 LED8.K
COL9
  Top 0.254: IC1.13 134.19,171.96 155.86,171.96 159.51,169.16 LED9.K
COL10
  Top 0.254: IC1.14 133.83,173.23 151.64,173.23 155.04,176.63 LED10.K
COL11
  Top 0.254: IC1.15 133.48,174.5 141.48,174.5 147.19,180.21 LED11.K
COL12
  Top 0.254: LED12.K 138.31,182.25 IC1.16
COL13
  Top 0.254: IC1.17 129,184.12 LED13.K
COL14
  Top 0.254: IC1.18 119.37,188.61 LED14.K
COL15
  Top 0.254: IC1.19 112.77,194.3 LED15.K
COL16
  Top 0.254: IC1.20 113.86,192.28 102.11,192.28 LED16.K
COL17
  Top 0.254: IC1.21 114.22,191.01 94.49,191.01 91.2,194.3 LED17.K
COL18
  Top 0.254: IC1.22 114.57,189.74 84.33,189.74 81.33,192.74 LED18.K
COL19
  Top 0.254: IC1.23 114.92,188.47 76.71,188.47 LED19.K
COL20
  Top 0.254: IC1.24 115.27,187.2 67.82,187.2 LED20.K
COL21
  Top 0.254: IC1.25 115.62,185.93 70.36,185.93 LED21.K
COL22
  Top 0.254: IC1.26 115.97,184.66 71.63,184.66 65.28,178.31 48.77,178.31 47.09,176.63 LED22.K
COL23
  Top 0.254: IC1.27 116.32,183.39 72.9,183.39 66.55,177.04 50.04,177.04 43.35,170.35 LED23.K
COL24
  Top 0.254: IC1.28 116.67,182.12 74.17,182.12 67.82,175.77 51.31,175.77 43.69,168.15 37.34,168.15 35.16,166.1 LED24.K
COL25
  Top 0.254: IC3.5 27.94,60.2 27.94,105.16 20.83,138.94 20.83,150.37 23.37,152.91 23.37,156.19 LED25.K
COL26
  Top 0.254: IC3.6 27.3,59.94 26.42,100.84 26.29,104.52 19.05,138.18 LED26.K
COL27
  Top 0.254: IC3.7 26.8,59.56 12.95,121.41 13.33,137.16 LED27.K
COL28
  Top 0.254: IC3.8 26.16,59.31 9.27,127 9.27,129.67 LED28.K
COL29
  Top 0.254: IC3.9 25.65,58.93 7.11,120.02 LED29.K
COL30
  Top 0.254: IC3.10 25.15,58.67 5.72,109.86 LED30.K
COL31
  Top 0.254: IC3.11 4.44,99.82 LED31.K
COL32
  Top 0.254: IC3.12 12.7,77.6 5.59,89.41 LED32.K
COL33
  Top 0.254: IC3.13 22.48,59.18 7.75,79.12 LED33.K
COL34
  Top 0.254: IC3.14 22.35,58.17 8.64,70.87 LED34.K
COL35
  Top 0.254: IC3.15 22.22,56.9 12.57,61.47 LED35.K
COL36
  Top 0.254: IC3.16 LED36.K
COL37
  Top 0.254: IC3.17 LED37.K
COL38
  Top 0.254: IC3.18 28.19,47.12 LED38.K
COL39
  Top 0.254: IC3.19 35.18,36.07 LED39.K
COL40
  Top 0.254: IC3.20 40.77,28.7 LED40.K
COL41
  Top 0.254: IC3.21 48.39,19.3 LED41.K
COL42
  Top 0.254: IC3.22 45.97,24.89 58.93,14.48 LED42.K
COL43
  Top 0.254: IC3.23 45.85,26.03 68.2,11.05 LED43.K
COL44
  Top 0.254: IC3.24 46.35,26.92 76.58,8.76 LED44.K
COL45
  Top 0.254: IC3.25 46.86,27.18 87.38,6.73 LED45.K
COL46
  Top 0.254: IC3.26 47.12,27.81 97.03,6.98 LED46.K
COL47
  Top 0.254: IC3.27 47.24,28.7 106.93,6.6 LED47.K
COL48
  Top 0.254: IC3.28 47.88,29.08 111,9.4 LED48.K
COL49
  Top 0.254: IC4.5 127.24,21.09 128.78,19.56 128.78,10.51 LED49.K
COL50
  Top 0.254: IC4.6 129.12,21.74 LED50.K
COL51
  Top 0.254: IC4.7 141.88,22.39 LED51.K
COL52
  Top 0.254: IC4.8 155.02,23.04 LED52.K
COL53
  Top 0.254: IC4.9 151.96,23.69 155.32,27.05 163.48,26.92 LED53.K
COL54
  Top 0.254: IC4.10 150.07,24.34 157.1,31.24 170.37,34.16 LED54.K
COL55
  Top 0.254: IC4.11 148.18,24.99 159.89,36.7 177.03,41.91 LED55.K
COL56
  Top 0.254: IC4.12 146.29,25.64 168.15,47.5 182.56,50.16 LED56.K
COL57
  Top 0.254: IC4.13 144.4,26.29 174.12,56.13 187.12,59.18 LED57.K
COL58
  Top 0.254: IC4.14 142.51,26.94 183.77,68.2 189.44,69.09 LED58.K
COL59
  Top 0.254: IC4.15 139.35,27.59 185.29,73.66 LED59.K
COL60
  Top 0.254: IC4.16 137.46,28.24 191.13,86.36 LED60.K
GND  (via drill 2.54, 5.08)
  other vias: 27.69,132.08 22.1,99.57 178.31,99.57 99.57,23.37 99.57,177.04
  pour Top (isolate 0.305): 202.44,202.44 -3.3,202.44 -3.3,-3.3 202.44,-3.3
MISO
  Top 0.254: SV1.2 27.18,144.02 28.45,145.29 32.26,145.29 37.34,150.37 50.04,150.37 54.11,154.44 IC2.16
MOSI
  Top 0.254: IC2.15 53.31,154.91 50.04,151.64 37.34,151.64 32.26,146.56 25.91,146.56 24.64,145.29 SV1.1
N$1
  Top 0.254: IC3.31 34.92,52.45 R2.2
N$7
  Top 0.254: IC2.7 43.02,158.53 X1.2 C3.1
N$8
  Top 0.254: IC2.8 45.84,157.73 X1.1 C4.1
N$13
  Top 0.254: IC1.31 118.99,177.04 R1.2
N$64
  Top 0.254: IC4.31 114.65,19.14 R3.2
RST  (via drill 2.54)
  Top 0.254: IC2.29 50.93,166.24 50.67,166.37 40.13,166.37 v34.8,162.05 S1.3
  Bottom 0.254: v34.8,162.05 SV1.5
SCK
  Top 0.254: SV1.3 29.72,142.75 30.99,144.02 32.26,144.02 37.34,149.1 50.04,149.1 55.12,154.18 55.12,157.25 IC2.17
SCLK  (via drill 0.51)  (3 unrouted)
  Top 0.254: 126.24,19.81 IC4.3 126.75,19.81 127.63,19.05 127.63,17.53 125.6,14.48 124.21,13.46 112.65,13.46 109.22,15.11 v103.76,29.84 | IC3.3 29.08,60.71 29.08,62.61 v38.99,64.77 | IC1.3 128.14,168.78 128.14,167.89 v127,163.83 | IC2.24 56.39,165.23 62.1,165.23 63.37,164.34 63.37,160.27 v64.01,159.64
  Bottom 0.254: v38.99,64.77 39.12,64.52 | v127,163.83 126.62,163.96 | 104.14,29.84 v103.76,29.84 99.57,29.72 | v64.01,159.64 64.52,159.89
  Bottom 0.508: 99.57,29.72 arc180 99.57,169.42 arc180 99.57,29.72
SIN  (via drill 0.51)
  Top 0.254: IC1.4 128.91,168.91 v129.29,168.15 | v58.42,162.69 58.67,162.56 IC2.23
  Bottom 0.254: v129.29,168.15 128.14,168.27 109.47,173.48 84.71,172.47 v58.42,162.69
SOUT  (via drill 0.51)  (1 unrouted)
  Top 0.254: IC3.4 28.45,60.45 28.45,63.5 40.64,66.17 v43.43,65.02 | IC1.29 117.35,180.34 113.41,180.34 105.54,173.86 v103,165.48
  Bottom 0.254: v43.43,65.02 46.35,60.45 | 103.38,165.61 v103,165.48 102.36,165.48 99.57,165.61
  Bottom 0.508: 99.57,165.61 arc-180 99.57,33.53 arc-180 99.57,165.61
SOUT_2
  Top 0.254: IC3.29 48.77,29.72 111.38,12.45 124.59,12.57 126.36,13.72 128.14,17.14 128.14,19.3 126.87,20.45 IC4.4
VCC  (via drill 0.3, 0.51, 2.54)
  Top 0.254: LED35.A 10.67,58.93 | IC2.4 46.98,160.9 | IC1.32 116.08,171.19 v116.08,168.78 | v117.22,17.27 IC4.32 | v42.54,57.02 41.66,57.02 IC3.32 | IC2.18 58.42,158.62 v58.8,157.86 57.66,160.15 IC2.20 | v39.88,162.81 C2.1
  Top 0.508: 49.97,159.33 IC2.6 | IC2.18 50.77,158.53 49.97,159.33 | 46.98,160.9 48.4,160.9 49.97,159.33 | SV1.4 32.26,138.94 33.53,137.67 37.34,137.67 v38.61,136.4 | IC2.4 44.56,160.93 43.69,161.8 C1.1 C2.1
  Bottom 0.254: 39.24,137.16 38.61,136.53 v38.61,136.4 38.68,136.3 38.67,136.3 | 103.38,28.45 102.74,28.45 102.62,28.58 102.69,28.68 102.7,28.52 | 99.57,197.36 arc-5 108.42,196.96 | 108.42,196.96 arc-6 118.41,195.52 | 118.41,195.52 arc-6 128.24,193.06 | 128.24,193.06 arc-6 137.73,189.6 | 137.73,189.6 arc-6 147.62,184.74 | 147.62,184.74 arc-6 156.17,179.31 | 156.17,179.31 arc-6 164.09,173.05 | 164.09,173.05 arc-6 171.35,165.98 | 171.35,165.98 arc-6 177.81,158.23 | 177.81,158.23 arc-6 183.46,149.82 | 183.46,149.82 arc-6 188.58,140.07 | 188.58,140.07 arc-6 192.29,130.65 | 192.29,130.65 arc-6 195,120.91 | 195,120.91 arc-6 196.69,110.94 | 196.69,110.94 arc-6 197.35,100.84 | 197.35,100.84 arc-6 196.96,90.74 | 196.96,90.74 arc-6 195.51,80.67 | 195.51,80.67 arc-6 193.06,70.9 | 193.06,70.9 arc-6 189.59,61.38 | 189.59,61.38 arc-6 184.74,51.51 | 184.74,51.51 arc-6 179.31,42.97 | 179.31,42.97 arc-6 173.05,35.04 | 173.05,35.04 arc-6 165.98,27.79 | 158.23,21.32 arc6 165.98,27.79 | 149.82,15.68 arc6 158.23,21.32 | 140.07,10.56 arc6 149.82,15.68 | 130.65,6.85 arc6 140.07,10.56 | 121.29,4.22 arc6 130.65,6.85 | 110.94,2.44 arc6 121.29,4.22 | 100.84,1.79 arc6 110.94,2.44 | 99.57,1.78 arc1 100.84,1.79 | 121.16,4.37 121.16,5.14 LED48.A 120.9,15.88 v117.22,17.27 | 121.16,4.37 121.16,4.32 | 116.07,168.75 v116.08,168.78 | 49.92,48.65 49.91,48.64 49.91,48.77 46.48,52.2 v42.54,57.02 | LED46.A 100.84,1.93 100.84,1.79 | 121.29,4.22 121.26,4.37 121.16,4.37 | LED45.A 90.75,3.43 90.75,2.59 90.72,2.18 | LED47.A 110.92,2.59 110.94,2.44 | LED44.A 80.72,4.88 80.72,4.01 80.64,3.63 | LED43.A 70.94,7.37 70.94,6.48 70.83,6.1 | LED49.A 130.61,8.15 130.61,6.98 130.65,6.85
  Bottom 0.254: LED42.A 61.47,9.96 61.3,9.57 | LED50.A 140,11.89 140,10.69 140.07,10.56 | LED41.A 51.77,14.71 51.57,14.37 | LED51.A 148.95,16.61 149.73,15.82 149.82,15.68 | LED40.A 43.84,20.73 43.23,20.12 43,19.8 | LED52.A 157.35,22.22 158.14,21.44 158.23,21.32 | LED39.A 35.92,26.97 35.33,26.39 35.05,26.08 | LED53.A 165.1,28.68 165.89,27.89 165.98,27.79 | LED31.A 2.18,98.3 1.79,98.29 | LED30.A 3.43,108.41 2.59,108.41 2.18,108.44 | LED32.A 2.84,88.21 2.44,88.17 | LED29.A 4.88,118.41 4.01,118.41 3.63,118.49 | LED33.A 5.41,78.23 4.57,78.23 4.16,78.14 | LED28.A 7.37,128.19 6.48,128.19 6.1,128.31 | LED34.A 8.15,68.53 7.24,68.53 6.88,68.41 | LED27.A 9.96,137.67 9.57,137.83 | LED35.A 11.89,59.13 10.97,59.13 10.61,58.96 | LED26.A 14.71,147.37 14.37,147.56 | LED36.A 16.61,50.19 16,49.58 15.65,49.37 | 19.8,156.13 20.12,155.91 20.73,155.3 LED25.A arc90 20.05,155.96 19.94,155.96 | LED37.A 22.22,41.78 21.61,41.17 21.3,40.94 | LED24.A 26.97,163.22 26.39,163.81 26.08,164.08 | LED38.A 28.68,34.04 28.07,33.43 27.78,33.16 | LED23.A 34.04,170.46 33.43,171.07 33.16,171.35 | LED54.A 172.16,35.92 172.92,35.15 173.05,35.04 | LED22.A 41.78,176.91 41.17,177.52 40.94,177.83 | LED55.A 178.41,43.84 179.2,43.05 179.31,42.97 | LED21.A 50.19,182.52 49.58,183.13 49.37,183.49 | LED56.A 184.61,51.59 184.74,51.51 | LED57.A 188.37,61.44 189.43,61.44 189.59,61.38 | LED20.A 59.13,187.25 59.13,188.16 58.96,188.53 | LED19.A 68.53,190.98 68.53,191.9 68.41,192.26 | LED58.A 192.91,70.94 193.06,70.9 | LED18.A 78.23,193.73 78.23,194.56 78.14,194.98 | LED59.A 194.33,80.7 195.38,80.7 195.51,80.67 | LED17.A 88.21,196.29 88.17,196.69 | LED60.A 195.71,90.75 196.8,90.75 196.96,90.74
  Bottom 0.254: LED16.A 98.3,196.95 98.29,197.35 | LED1.A 197.21,100.84 197.35,100.84 | LED15.A 108.41,195.71 108.41,196.8 108.42,196.96 | LED2.A 196.55,110.92 196.69,110.94 | LED14.A 118.39,194.26 118.39,195.4 118.41,195.52 | LED3.A 194.84,120.88 195,120.91 | LED13.A 128.19,191.77 128.19,192.91 128.24,193.06 | LED4.A 190.98,130.61 192.15,130.61 192.29,130.65 | LED12.A 137.67,189.46 137.73,189.6 | LED5.A 187.25,140 188.44,140 188.58,140.07 | LED11.A 147.55,184.61 147.62,184.74 | LED6.A 182.52,148.95 183.31,149.73 183.46,149.82 | LED10.A 155.3,178.41 156.08,179.2 156.17,179.31 | LED8.A 170.46,165.1 171.25,165.89 171.35,165.98 | LED7.A 176.91,157.35 177.7,158.14 177.81,158.23 | LED9.A 163.22,172.16 163.98,172.92 164.09,173.05 | v58.8,157.86 59.31,158.24
  Bottom 0.508: SV1.4 32.26,146.56 v27.18,150.5 LED25.A | v39.88,162.81 LED23.A | 99.57,28.45 arc3 102.7,28.52 arc164 116.07,168.75 arc13 99.57,170.69 arc59 38.67,136.3 arc77 49.92,48.65 arc44 99.57,28.45
  Bottom 0.762: 99.57,197.36 arc1 98.29,197.35 arc6 88.17,196.69 arc6 78.14,194.98 arc6 68.41,192.26 arc6 58.96,188.53 arc6 49.37,183.49 arc6 40.94,177.83 arc6 33.16,171.35 arc6 26.08,164.08 arc6 19.8,156.13 arc6 14.37,147.56 arc6 9.57,137.83 arc6 6.1,128.31 arc6 3.63,118.49 arc6 2.18,108.44 arc6 1.79,98.29 arc6 2.44,88.17 arc6 4.16,78.14 arc6 6.88,68.41 arc6 10.61,58.96 arc6 15.65,49.37 arc6 21.3,40.94 arc6 27.78,33.16 arc6 35.05,26.08 arc6 43,19.8 arc6 51.57,14.37 arc6 61.3,9.57 arc6 70.83,6.1 arc6 80.64,3.63 arc6 90.72,2.18 arc5 99.57,1.78
XLAT  (via drill 0.51)  (2 unrouted)
  Top 0.254: IC2.26 53.31,166.34 54.74,167.89 81.53,167.89 v82.8,164.85 | IC4.30 114.57,19.79 v108.58,32.89 | IC3.30 37.72,46.99 39.62,46.61 v51.31,52.7 | IC1.30 117.35,179.58 115.19,179.58 107.19,173.48 v105.79,166.75
  Bottom 0.254: v108.58,32.89 108.08,32.77 | 82.3,164.72 v82.8,164.85 84.84,165.35 89.66,166.24 95,166.75 99.57,166.88 v105.79,166.75 106.05,166.62
  Bottom 0.508: 99.57,166.88 arc-180 99.57,32.26 arc-180 99.57,166.88
(copper drawn outside any net)
  shapes: Bottom circle x1